# Altium schematic sheet POGO_Tester_Rev1_Top_Level.SchDoc
size OrCAD B; SheetNumber: 1; SheetTotal: 2
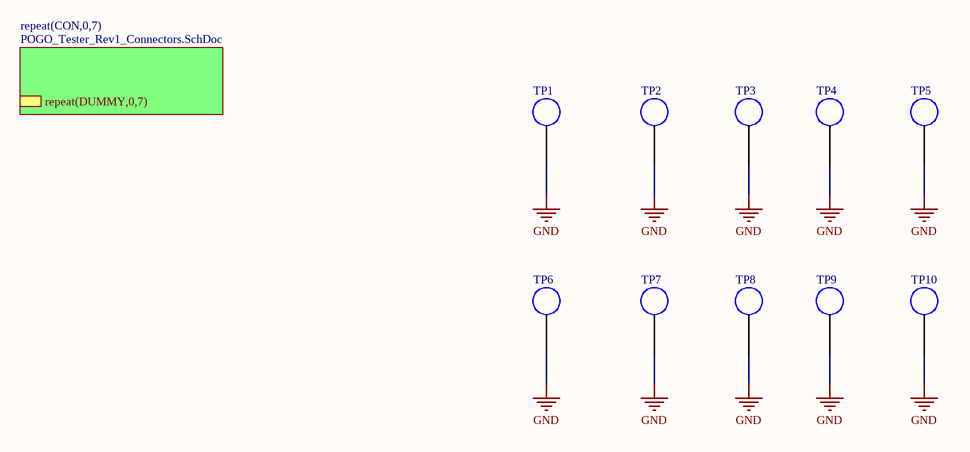
[diagram p0: POGO_Tester_Rev1_Top_Level.SchDoc]

## Parts
TP1  DNI  [250milx400mil]  (value not drawn)
TP2  DNI  [250milx400mil]  (value not drawn)
TP3  DNI  [250milx400mil]  (value not drawn)
TP4  DNI  [250milx400mil]  (value not drawn)
TP5  DNI  [250milx400mil]  (value not drawn)
TP6  DNI  [250milx400mil]  (value not drawn)
TP7  DNI  [250milx400mil]  (value not drawn)
TP8  DNI  [250milx400mil]  (value not drawn)
TP9  DNI  [250milx400mil]  (value not drawn)
TP10  DNI  [250milx400mil]  (value not drawn)

## Sub-sheets
repeat(CON,0,7) = POGO_Tester_Rev1_Connectors.SchDoc: repeat(DUMMY,0,7)

## Nets
GND: TP1.1 TP2.1 TP3.1 TP4.1 TP5.1 TP6.1 TP7.1 TP8.1 TP9.1 TP10.1

## Library data of the parts
TP1-TP10 = TEST POINT: 250milx400mil Square Pad